# EAGLE design placa_potencia (EAGLE 6.5.0)
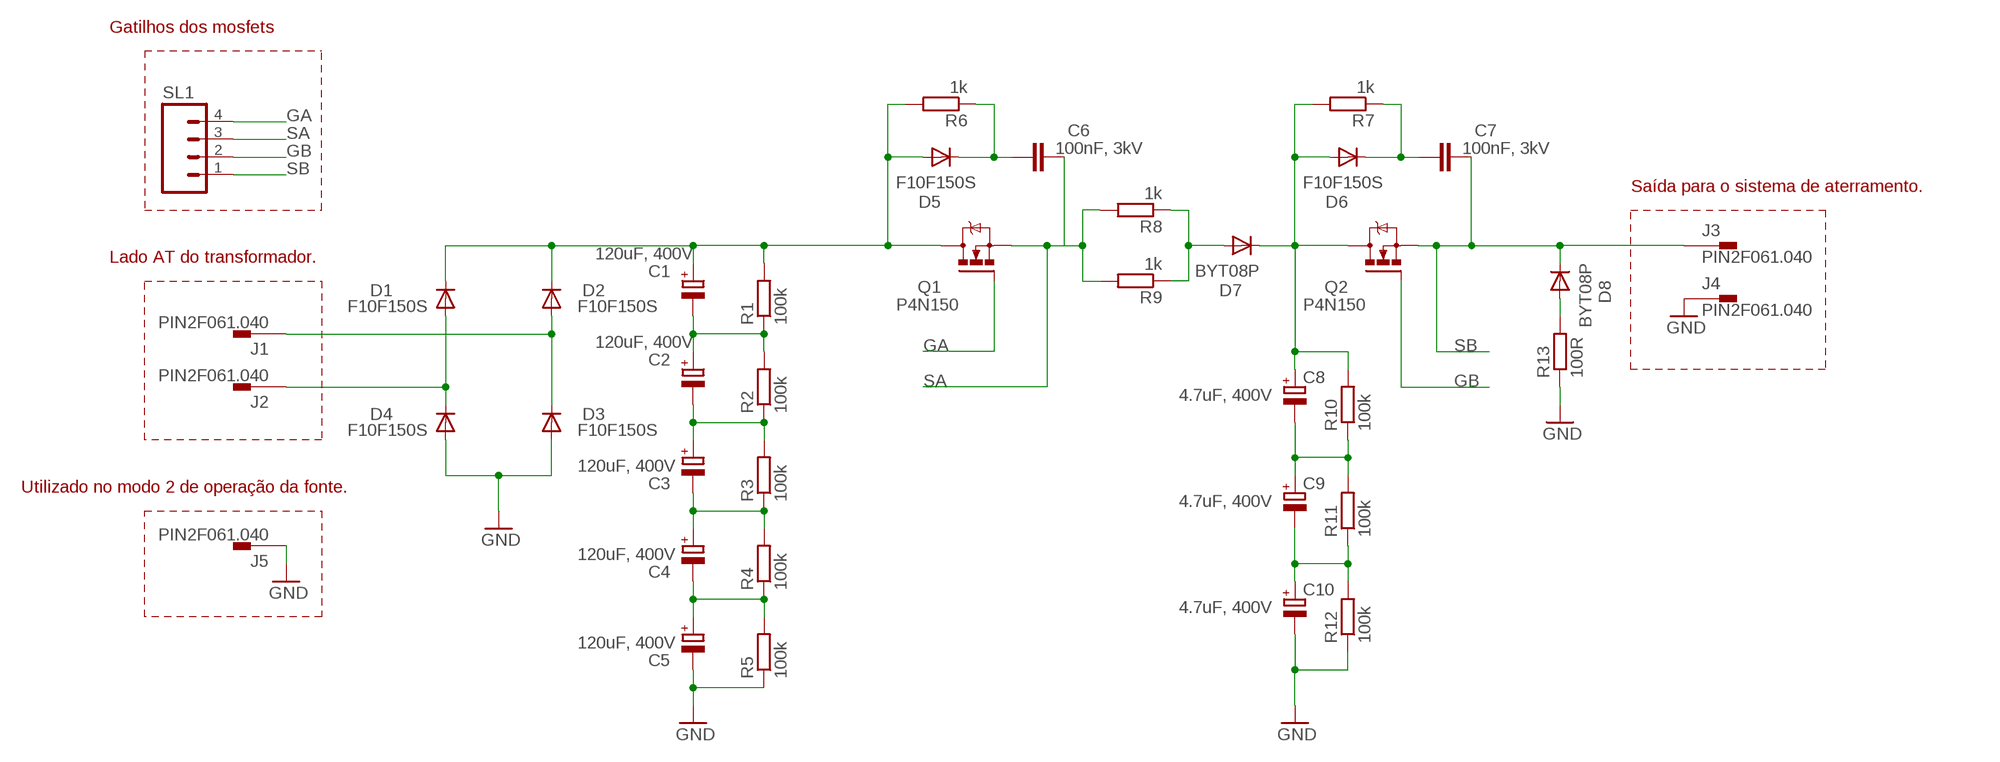
[diagram p0: schematic, sheet 1]

## Parts
C1  120uF, 400V  CPOL-EUE7.5-16  [E7,5-16]
C2  120uF, 400V  CPOL-EUE7.5-16  [E7,5-16]
C3  120uF, 400V  CPOL-EUE7.5-16  [E7,5-16]
C4  120uF, 400V  CPOL-EUE7.5-16  [E7,5-16]
C5  120uF, 400V  CPOL-EUE7.5-16  [E7,5-16]
C6  100nF, 3kV  C-EU050-035X075  [C050-035X075]
C7  100nF, 3kV  C-EU050-035X075  [C050-035X075]
C8  4.7uF, 400V  CPOL-EUE5-8.5  [E5-8,5]
C9  4.7uF, 400V  CPOL-EUE5-8.5  [E5-8,5]
C10  4.7uF, 400V  CPOL-EUE5-8.5  [E5-8,5]
D1  F10F150S  BYT08P  [TO220ACS]
D2  F10F150S  BYT08P  [TO220ACS]
D3  F10F150S  BYT08P  [TO220ACS]
D4  F10F150S  BYT08P  [TO220ACS]
D5  F10F150S  BYT08P  [TO220ACS]
D6  F10F150S  BYT08P  [TO220ACS]
D7  BYT08P  [TO220ACS]
D8  BYT08P  [TO220ACS]
J1  PIN2F061.040  [F061.040]
J2  PIN2F061.040  [F061.040]
J3  PIN2F061.040  [F061.040]
J4  PIN2F061.040  [F061.040]
J5  PIN2F061.040  [F061.040]
Q1  P4N150  IRF520  [TO220BV]
Q2  P4N150  IRF520  [TO220BV]
R1  100k  R-EU_0617/22  [0617/22]
R2  100k  R-EU_0617/22  [0617/22]
R3  100k  R-EU_0617/22  [0617/22]
R4  100k  R-EU_0617/22  [0617/22]
R5  100k  R-EU_0617/22  [0617/22]
R6  1k  R-EU_0617/22  [0617/22]
R7  1k  R-EU_0617/22  [0617/22]
R8  1k  R-EU_0617/22  [0617/22]
R9  1k  R-EU_0617/22  [0617/22]
R10  100k  R-EU_0617/22  [0617/22]
R11  100k  R-EU_0617/22  [0617/22]
R12  100k  R-EU_0617/22  [0617/22]
R13  100R  R-EU_0617/22  [0617/22]
SL1  M04  [04P]

## Nets
GA: Q1.G SL1.4
GB: Q2.G SL1.2
GND: C5.- C10.- D3.A D4.A J4.A1 J4.A2 J5.A1 J5.A2 R5.1 R12.1 R13.1
N$1: D1.A D4.C J2.A1 J2.A2
N$2: D2.A D3.C J1.A1 J1.A2
N$3: C1.- C2.+ R1.1 R2.2
N$4: C2.- C3.+ R2.1 R3.2
N$5: C3.- C4.+ R3.1 R4.2
N$6: C8.- C9.+ R10.1 R11.2
N$7: C6.1 D5.C R6.1
N$9: C4.- C5.+ R4.1 R5.2
N$10: D8.A R13.2
N$11: C7.1 D6.C R7.1
N$13: D7.A R8.1 R9.1
N$15: C1.+ D1.C D2.C D5.A Q1.D R1.2 R6.2
N$16: C9.- C10.+ R11.1 R12.2
SA: C6.2 Q1.S R8.2 R9.2 SL1.3
SB: C7.2 D8.C J3.A1 J3.A2 Q2.S SL1.1
VCC1: C8.+ D6.A D7.C Q2.D R7.2 R10.2

## Notes on the sheet
- Gatilhos dos mosfets
- Saída para o sistema de aterramento.
- Lado AT do transformador.
- Utilizado no modo 2 de operação da fonte.

## Library data of the parts
C1-C5 C8-C10 = resistor:CPOL-EU: POLARIZED CAPACITOR, European symbol
C6 C7 = rcl:C-EU: CAPACITOR, European symbol
D1-D8 = diode:BYT08P: DIODE ultra fast
J1-J5 = con-faston:PIN2: Flachstecker Typ Tyco/Electronics/AMP TAB, FASTON Printed Circuit Board Tabs Source: http://www.buerklin.com, http://catalog.tycoelectronics.com; OC_FARNELL: unknown; OC_NEWARK: unknown
Q1 Q2 = transistor-power:IRF520: HEXFET Power MOSFET
R1-R13 = resistor:R-EU_: RESISTOR, European symbol
SL1 = con-amp-quick:M04: AMP QUICK CONNECTOR; OC_FARNELL: unknown; OC_NEWARK: unknown

## Board
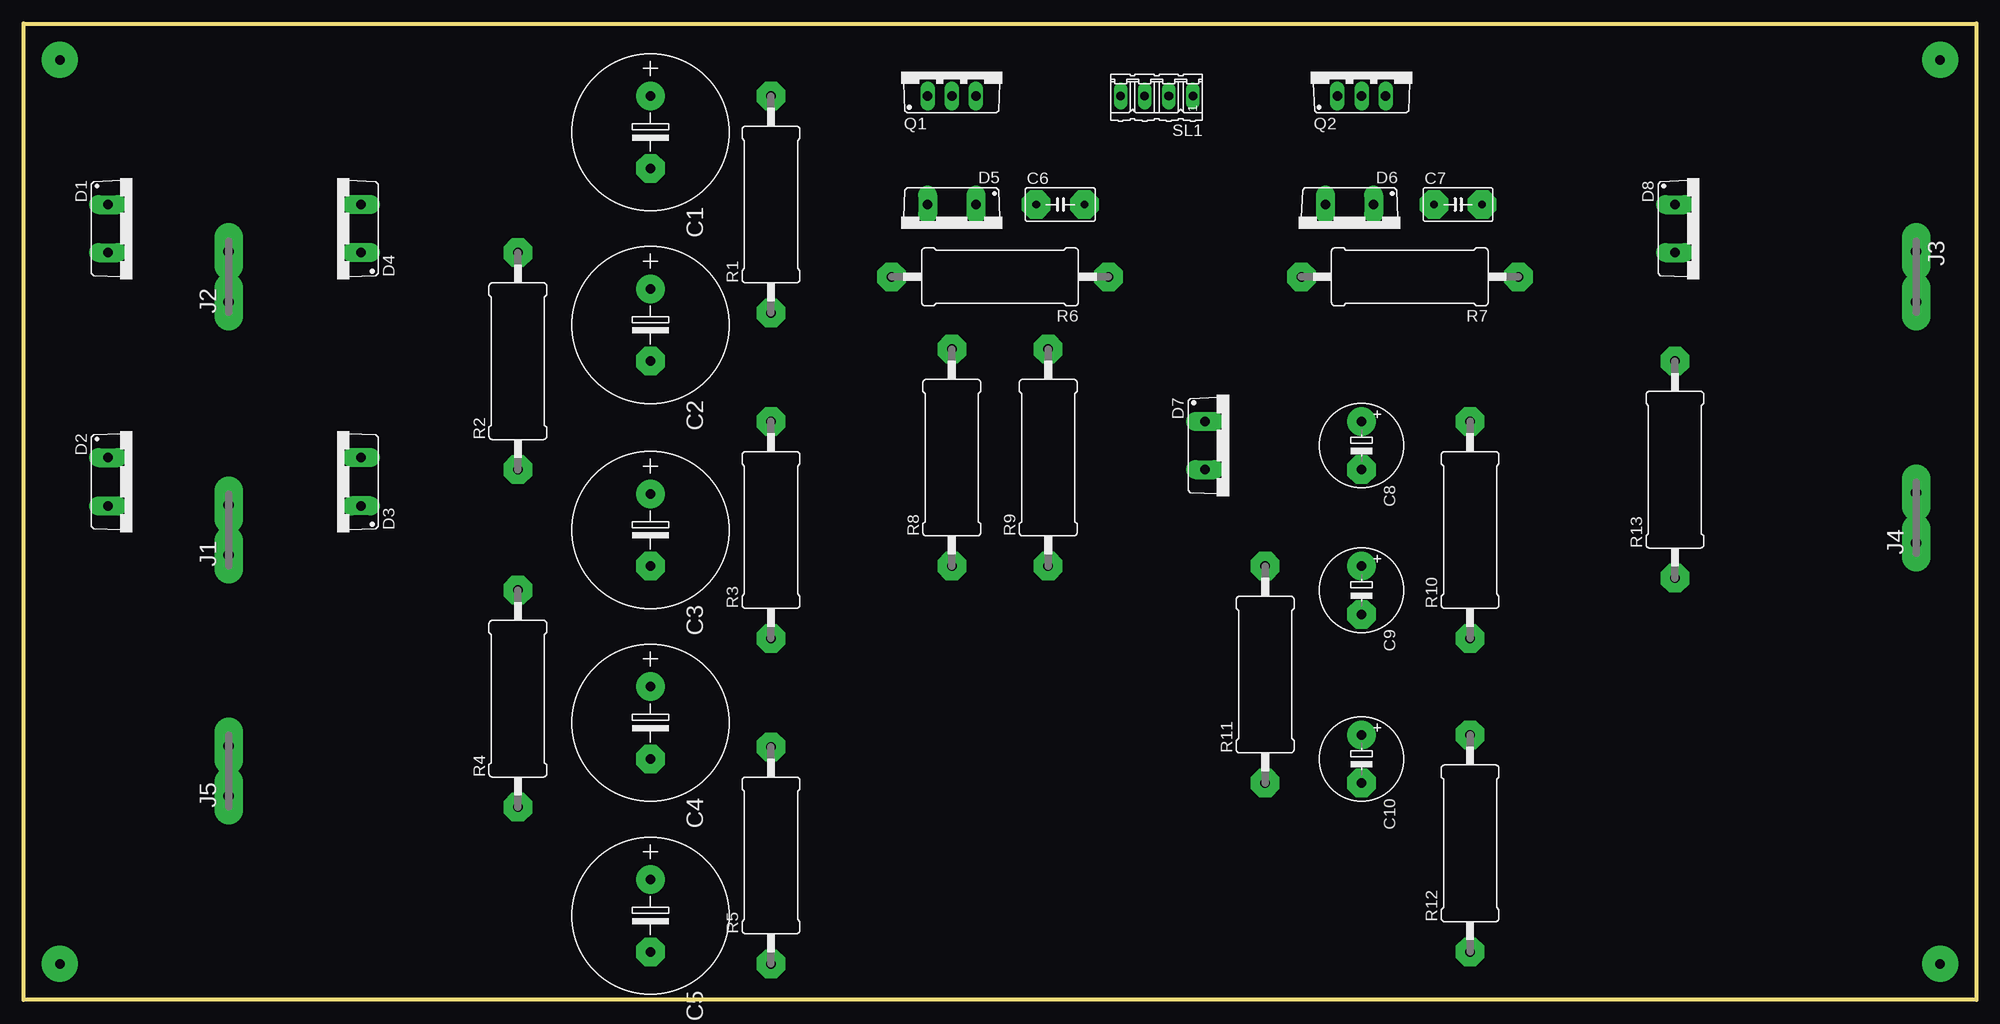
[diagram p1: board, top side]
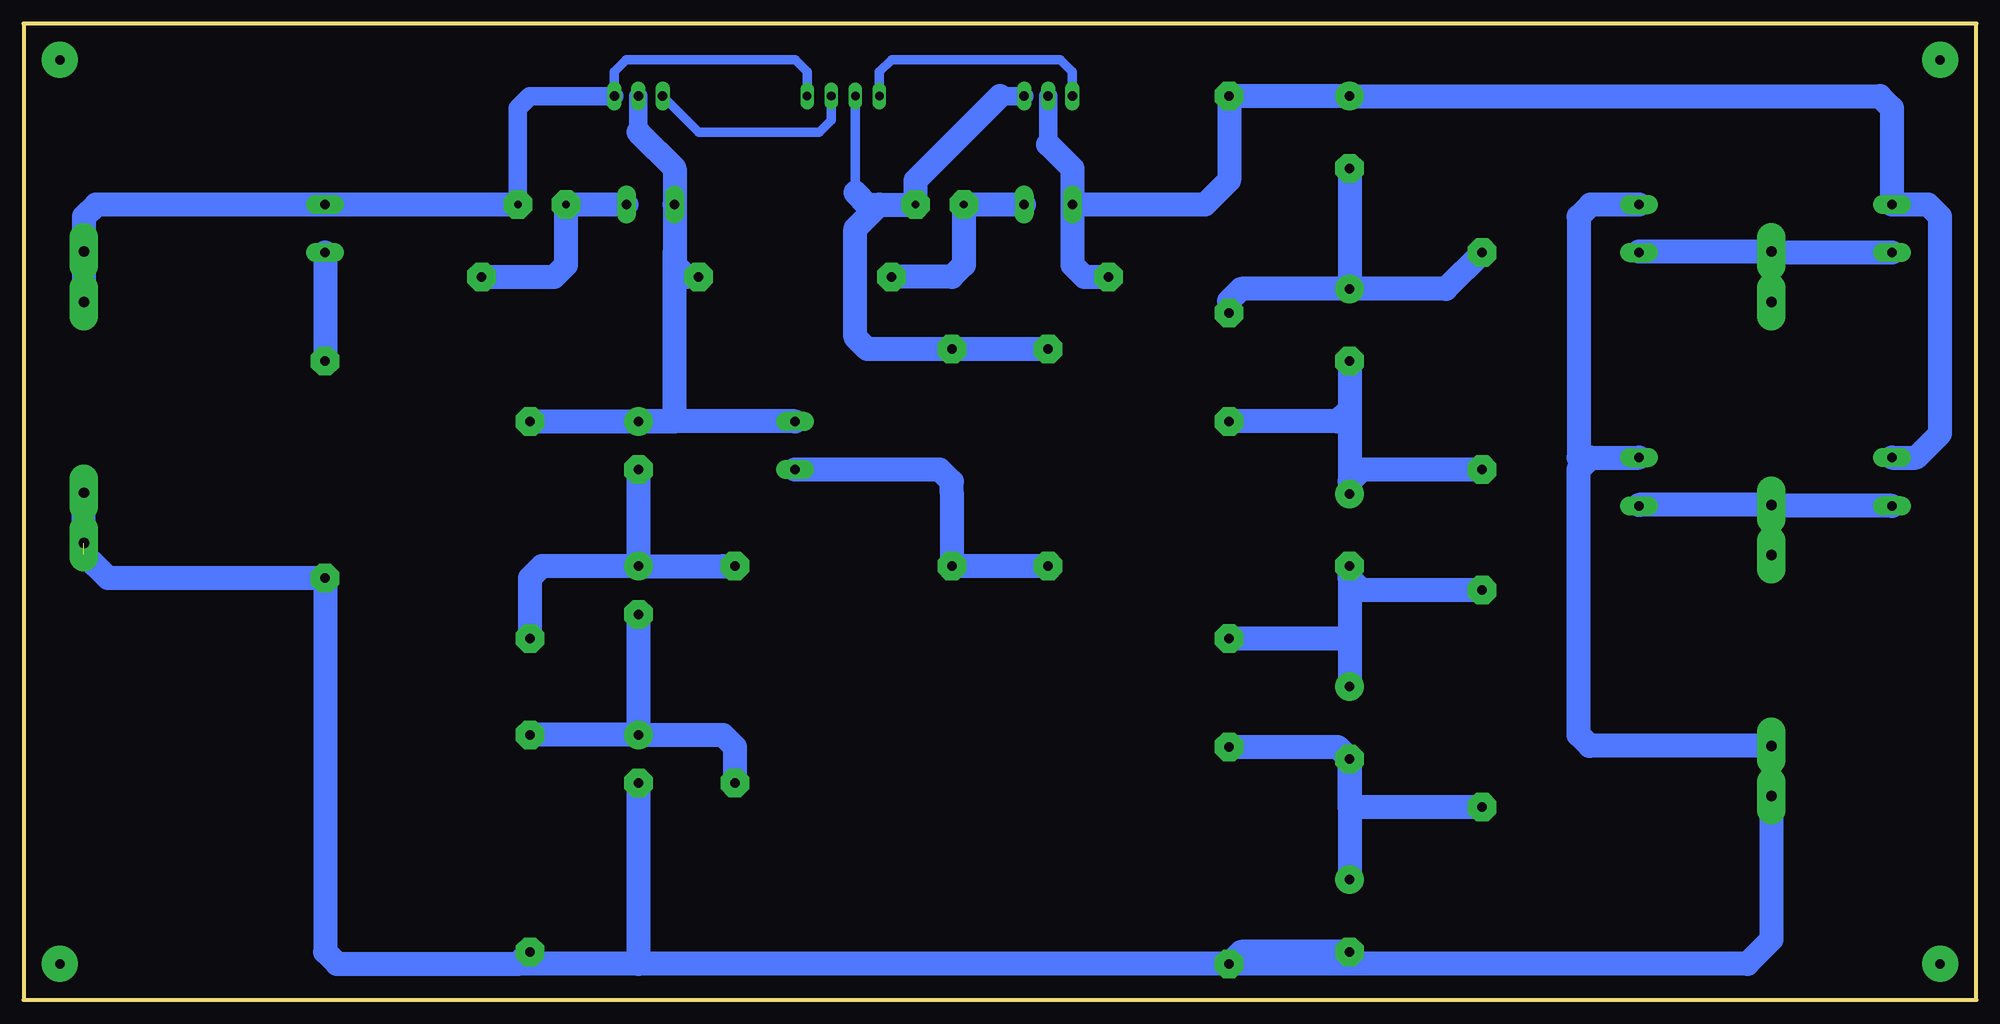
[diagram p2: board, bottom side, seen from below]

Size 205.74 x 102.87 mm. Coordinates in mm from the lower left corner, seen from the top.
Outline: 0,102.87 205.74,102.87 205.74,0 0,0 0,102.87
Copper layers (1*16): Top 0.035mm / dielectric 1.5mm / Bottom 0.035mm
Design rules "default": minimum track width 10mil, minimum drill 24mil, track to track 8mil, track to pad 8mil, pad to pad 8mil, via to via 8mil, smd to smd 8mil, copper to edge 40mil, drill to drill 8mil, minimum pad ring 10mil, minimum via ring 8mil, stop-mask expansion 4mil, vias tented up to drill 0mil, thermal gap 10mil

### Footprints (pad centres in the part's own frame; a part is rotated, then mirrored left to right if it is on the bottom)
E7,5-16 = drill 1 pad 3: + -3.81,0 | drill 1 pad 3 octagon: - 3.81,0
C050-035X075 = drill 0.813 pad 3 octagon: 1 -2.54,0; 2 2.54,0
E5-8,5 = drill 1 pad 3: + -2.54,0 | drill 1 pad 3 octagon: - 2.54,0
TO220ACS = drill 1 pad 2 long: A 2.54,-2.54; C -2.54,-2.54
F061.040 = drill 1.1 pad 3 long: A1 -2.65,0; A2 2.65,0
TO220BV = drill 1 long: D 0,-2.54; G -2.54,-2.54; S 2.54,-2.54
0617/22 = drill 1 pad 3 octagon: 1 -11.43,0; 2 11.43,0
04P = drill 0.914 long: 1 -3.81,0; 2 -1.27,0; 3 1.27,0; 4 3.81,0

### Placement (x,y rotation side)
C1  66.04,91.44 270 top
C2  66.04,71.12 270 top
C3  66.04,49.53 270 top
C4  66.04,29.21 270 top
C5  66.04,8.89 270 top
C6  109.22,83.82 0 top
C7  151.13,83.82 0 top
C8  140.97,58.42 270 top
C9  140.97,43.18 270 top
C10  140.97,25.4 270 top
D1  11.43,81.28 270 top
D2  11.43,54.61 270 top
D3  33.02,54.61 90 top
D4  33.02,81.28 90 top
D5  97.79,81.28 180 top
D6  139.7,81.28 180 top
D7  127,58.42 270 top
D8  176.53,81.28 270 top
J1  21.59,49.53 90 top
J2  21.59,76.2 90 top
J3  199.39,76.2 270 top
J4  199.39,50.8 90 top
J5  21.59,24.13 90 top
Q1  97.79,97.79 0 top
Q2  140.97,97.79 0 top
R1  78.74,83.82 90 top
R2  52.07,67.31 90 top
R3  78.74,49.53 90 top
R4  52.07,31.75 90 top
R5  78.74,15.24 90 top
R6  102.87,76.2 180 top
R7  146.05,76.2 180 top
R8  97.79,57.15 90 top
R9  107.95,57.15 90 top
R10  152.4,49.53 90 top
R11  130.81,34.29 90 top
R12  152.4,16.51 90 top
R13  173.99,55.88 90 top
SL1  119.38,95.25 180 top

### Tracks (layer width: path | path; a pad name or v marks a point on that pad's centre or on a via)
GA
  Bottom 1.016: Q1.G 95.25,97.79 96.52,99.06 114.3,99.06 115.57,97.79 SL1.4
GB
  Bottom 1.016: Q2.G 134.62,91.44 121.92,91.44 120.65,92.71 SL1.2
GND  (1 unrouted)
  Bottom 1.93: J5.A1 21.59,25.4 J5.A2
  Bottom 2.54: 153.67,3.81 172.72,3.81 173.99,5.08 R13.1 196.85,44.45 198.12,45.72 199.39,46.99 199.39,52.07 J4.A2 | 153.67,3.81 R12.1 | R5.1 140.97,3.81 | 140.97,3.81 153.67,3.81 | C10.- 140.97,3.81 | J5.A1 21.59,6.35 24.13,3.81 R5.1 | C5.- 77.47,5.08 R5.1 | J5.A2 40.75,26.78 41.91,27.94 41.91,55.88 41.27,56.52 | 41.27,56.52 40.64,57.15 D3.A | D4.A 40.64,83.82 41.91,82.55 41.91,57.15 41.27,56.52
N$1
  Bottom 1.93: 21.59,78.74 J2.A2 21.59,77.47 J2.A1 | 35.56,78.85 D4.C
  Bottom 2.54: D1.A 21.59,78.74 | J2.A2 35.56,78.85
N$2
  Bottom 1.93: 21.59,52.07 J1.A2 J1.A1 | 35.56,52.18 D3.C
  Bottom 2.54: D2.A 21.59,52.07 | J1.A2 35.56,52.18
N$3
  Bottom 2.54: C1.- C2.+ | R2.2 55.88,74.93 C2.+ | C2.+ 77.47,74.93 78.74,73.66 R1.1
N$4
  Bottom 2.54: R3.2 67.31,60.96 66.04,62.23 C2.- 66.04,54.61 | 66.04,54.61 C3.+ | R2.1 64.77,55.88 66.04,54.61
N$5
  Bottom 2.54: R4.2 64.77,43.18 66.04,44.45 C3.- 66.04,38.1 | 66.04,38.1 C4.+ | R3.1 66.04,38.1
N$6
  Bottom 2.54: C8.- C9.+ | C9.+ 151.13,45.72 152.4,44.45 R10.1 | C9.+ 132.08,45.72 R11.2
N$7
  Bottom 2.54: D5.C C6.1 106.68,77.47 107.95,76.2 R6.1
N$8  (via drill 1 pad 3.81)
  other vias: 3.81,99.06
N$9
  Bottom 2.54: R4.1 66.04,20.32 66.04,24.13 C4.- | C4.- C5.+ | R5.2 67.31,26.67 C4.-
N$10
  Bottom 2.54: D8.A R13.2
N$11
  Bottom 2.54: D6.C 147.32,83.82 C7.1 148.59,77.47 149.86,76.2 R7.1
N$12  (via drill 1 pad 3.81)
  other vias: 3.81,3.81
N$13
  Bottom 2.54: R8.1 R9.1 107.95,53.34 107.95,54.61 109.22,55.88 D7.A
N$14  (via drill 1 pad 3.81)
  other vias: 201.93,3.81
N$15
  Bottom 1.93: Q1.D 97.79,90.17
  Bottom 2.54: D2.C 6.35,57.15 3.81,59.69 3.81,82.55 5.08,83.82 D1.C 8.89,93.98 10.16,95.25 C1.+ R1.2 78.74,86.36 81.28,83.82 D5.A | 97.79,90.17 95.25,87.63 D5.A | D5.A 95.25,77.47 93.98,76.2 R6.2
N$16
  Bottom 2.54: C9.- C10.+ | C10.+ 132.08,27.94 130.81,26.67 R11.1 | C10.+ R12.2
N$17  (via drill 1 pad 3.81)
  other vias: 201.93,99.06
SA
  Bottom 1.016: SL1.3 118.11,85.09
  Bottom 1.93: 102.87,95.25 Q1.S
  Bottom 2.54: 102.87,95.25 110.49,87.63 111.76,86.36 C6.2 115.57,83.82 | 118.11,85.09 116.84,83.82 115.57,83.82 | 115.57,83.82 118.11,81.28 118.11,69.85 116.84,68.58 R9.2 R8.2
SB
  Bottom 1.016: SL1.1 123.19,97.79 124.46,99.06 142.24,99.06 143.51,97.79 Q2.S
  Bottom 1.93: Q2.S 152.4,95.25 153.67,93.98 C7.2
  Bottom 2.54: C7.2 D8.C 198.12,83.82 199.39,82.55 J3.A1 J3.A2
VCC1
  Bottom 1.93: 135.89,76.2 R7.2 | Q2.D 140.97,91.44
  Bottom 2.54: 137.16,78.74 D6.A 137.16,87.63 140.97,91.44 | 137.16,78.74 137.16,77.47 135.89,76.2 | R10.2 C8.+ | D7.C 137.16,60.96 | 137.16,60.96 C8.+ | C8.+ 137.16,60.96 | 137.16,60.96 137.16,78.74